# Altium schematic sheet DAC.SchDoc
size A; SheetNumber: 3; SheetTotal: 6
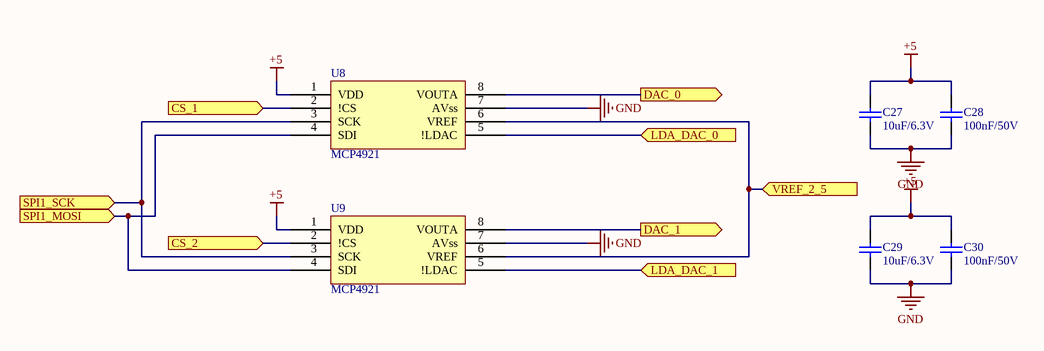
[diagram p0: DAC.SchDoc]

## Parts
C27  10uF/6.3V  [CAP_0805]
C28  100nF/50V  [CAP_0805]
C29  10uF/6.3V  [CAP_0805]
C30  100nF/50V  [CAP_0805]
U8  MCP4921  [SOIC127P600X175-8N]
U9  MCP4921  [SOIC127P600X175-8N]

## Ports
CS_1 (in), CS_2 (in), DAC_0 (out), DAC_1 (out), LDA_DAC_0 (in), LDA_DAC_1 (in), SPI1_MOSI (in), SPI1_SCK (in), VREF_2_5 (in)

## Nets
+5: C27.2 C28.2 C29.2 C30.2 U8.1(VDD) U9.1(VDD)
GND: C27.1 C28.1 C29.1 C30.1 U8.7(AVss) U9.7(AVss)
CS_1: U8.2(!CS) ; port CS_1
CS_2: U9.2(!CS) ; port CS_2
DAC_0: U8.8(VOUTA) ; port DAC_0
DAC_1: U9.8(VOUTA) ; port DAC_1
LDA_DAC_0: U8.5(!LDAC) ; port LDA_DAC_0
LDA_DAC_1: U9.5(!LDAC) ; port LDA_DAC_1
SPI1_MOSI: U8.4(SDI) U9.4(SDI) ; port SPI1_MOSI
SPI1_SCK: U8.3(SCK) U9.3(SCK) ; port SPI1_SCK
VREF_2_5: U8.6(VREF) U9.6(VREF) ; port VREF_2_5

## Library data of the parts
C27-C30 = Capacitor: Size: 0805
  C27 C29: URL: https://www.thegioiic.com/tu-gom-0805-10uf-6-3v; Value: 10uF/6.3V
  C28 C30: URL: https://www.thegioiic.com/tu-gom-0805-100nf-0-1uf-50v; Value: 100nF/50V
U8 U9 = MCP4921: Interface SPI; Value: MCP4921-E/SN; Size: 8-SOIC; URL: https://www.thegioiic.com/mcp4921-e-sn-ic-dac-12-bit-1-channel-8-soic